# Altium schematic sheet LCD_TFT.SchDoc
size A; SheetNumber: 2; SheetTotal: 5
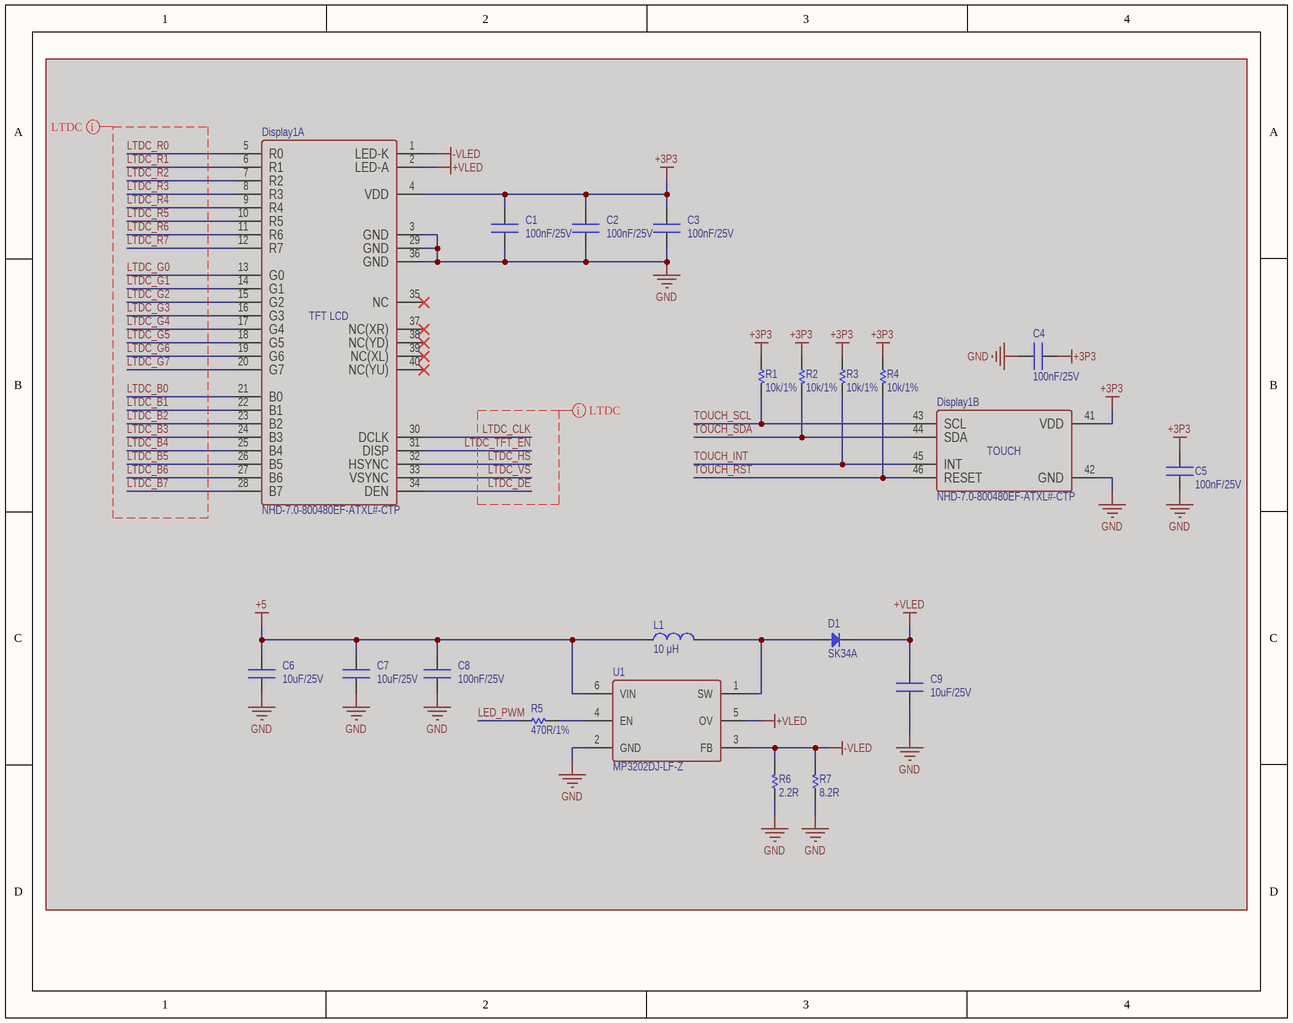
[diagram p0: LCD_TFT.SchDoc]

## Parts
C1  100nF/25V  [CN-SMD-0603]  (masked out: inside a compile mask, not in the netlist)
C2  100nF/25V  [CN-SMD-0603]  (masked out: inside a compile mask, not in the netlist)
C3  100nF/25V  [CN-SMD-0603]  (masked out: inside a compile mask, not in the netlist)
C4  100nF/25V  [CN-SMD-0603]  (masked out: inside a compile mask, not in the netlist)
C5  100nF/25V  [CN-SMD-0603]  (masked out: inside a compile mask, not in the netlist)
C6  10uF/25V  [CN-SMD-0603]  (masked out: inside a compile mask, not in the netlist)
C7  10uF/25V  [CN-SMD-0603]  (masked out: inside a compile mask, not in the netlist)
C8  100nF/25V  [CN-SMD-0603]  (masked out: inside a compile mask, not in the netlist)
C9  10uF/25V  [CN-SMD-0603]  (masked out: inside a compile mask, not in the netlist)
D1  SK34A  [DIO-SMD-A]  (masked out: inside a compile mask, not in the netlist)
Display1  NHD-7.0-800480EF-ATXL#-CTP  [NHD-7.0-800480EF-ATXL#-CTP]  (parts A,B of 2)  (masked out: inside a compile mask, not in the netlist)
L1  10 μH  [L-SMD-M-5x5]  (masked out: inside a compile mask, not in the netlist)
R1  10k/1%  [RES-SMD-0603]  (masked out: inside a compile mask, not in the netlist)
R2  10k/1%  [RES-SMD-0603]  (masked out: inside a compile mask, not in the netlist)
R3  10k/1%  [RES-SMD-0603]  (masked out: inside a compile mask, not in the netlist)
R4  10k/1%  [RES-SMD-0603]  (masked out: inside a compile mask, not in the netlist)
R5  470R/1%  [RES-SMD-0603]  (masked out: inside a compile mask, not in the netlist)
R6  2.2R  [RES-SMD-0805]  (masked out: inside a compile mask, not in the netlist)
R7  8.2R  [RES-SMD-0805]  (masked out: inside a compile mask, not in the netlist)
U1  MP3202DJ-LF-Z  [SOT23-6]  (masked out: inside a compile mask, not in the netlist)

## Layout directives
net class LTDC: LTDC_B0, LTDC_B1, LTDC_B2, LTDC_B3, LTDC_B4, LTDC_B5, LTDC_B6, LTDC_B7, LTDC_CLK, LTDC_DE, LTDC_G0, LTDC_G1, LTDC_G2, LTDC_G3, LTDC_G4, LTDC_G5, LTDC_G6, LTDC_G7, LTDC_HS, LTDC_R0, LTDC_R1, LTDC_R2, LTDC_R3, LTDC_R4, LTDC_R5, LTDC_R6, LTDC_R7, LTDC_TFT_EN, LTDC_VS

## Notes on the sheet
- (in symbol NHD-7.0-800480EF-ATXL#-CTP, part A) TFT LCD
- (in symbol NHD-7.0-800480EF-ATXL#-CTP, part B) TOUCH

## Library data of the parts
C1-C5 C8 = CN: CAP CER 0.1UF 25V X7R 0603; PN: CL10B104KA8NNNC
  C1: ComponentLink1Description: PN; ComponentLink1URL: CL10B104KA8NNNC
C6 C7 C9 = CN: CAP CER 10UF 25V X5R 0603; PN: CL10A106MA8NRNC
D1 = Diode SMD: DIODE SCHOTTKY 40V 3A DO214AC; Code - JEDEC: DO-214-AB; Published: 8-Jun-2000; Revision: July-2002: Re-released for DXP Platform.; Publisher: Altium Limited; PN: SK34A
Display1 = NHD-7.0-800480EF-ATXL#-CTP: TFT (Thin-Film-Transistor) Color Liquid Crystal Display Module, 0541044031 + 52271-0679; PN: NHD-7.0-800480EF-ATXL#-CTP
L1 = L-SMD-1: FIXED IND 10UH 1.2A 125 MOHM SMD; Manufacturer: Wurth Elektronik; PN: NRS5024T100MMGJ; Inductance: 10 μH; ComponentLink1Description: Manufacturer; ComponentLink1URL: http://www.we-online.de; Created by: Baojun Chen; Created Date: Nov.2015; ComponentLink2Description: Datasheet; ComponentLink2URL: http://katalog.we-online.de/pbs/datasheet/78477010.pdf
R1-R4 = Res-SMD: RES SMD 10K OHM 1% 1/10W 0603; Manufacturer: Generic Components; Class: Passive; PN: ERJ-3EKF1002V; Published: 08/06/2000; Publisher: Altium Hobart Technology Centre
R5 = Res-SMD: RES 470 OHM 1% 1/10W 0603; Manufacturer: Generic Components; PN: RC0603FR-07470RL; Published: 08/06/2000; Publisher: Altium Hobart Technology Centre
R6 = Res-SMD: RES 2.2 OHM 5% 1/8W 0805; Manufacturer: Generic Components; PN: RMCF0805JT2R20; Class: Passive; Publisher: Altium Hobart Technology Centre
R7 = Res-SMD: RES 8.2 OHM 1% 1/8W 0805; Manufacturer: Generic Components; PN: RMCF0805FT8R20; Class: Passive; Publisher: Altium Hobart Technology Centre
U1 = MP3202: IC LED DRVR RGLTR PWM TSOT23-6; PN: MP3202DJ-LF-Z